# Altium schematic sheet Sheet1.SchDoc
size A4
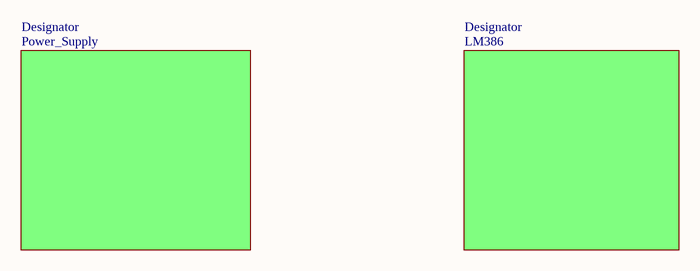
[diagram p0: Sheet1.SchDoc]

## Sub-sheets
Designator = Power_Supply: no entries
Designator = LM386: no entries